# Altium project esp32_motor_driver.PrjPcb
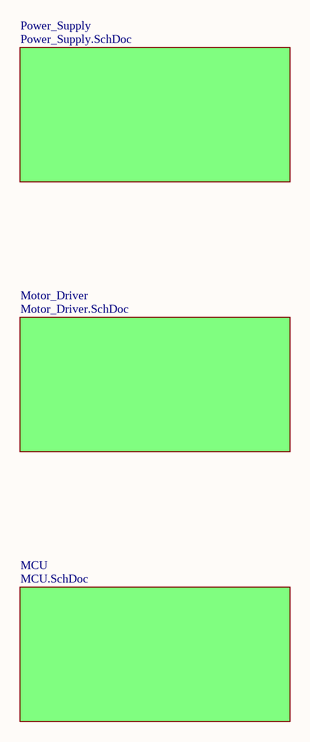
[diagram p0: Top_Level.SchDoc]
Description1: It's RC Cars that play Laser Tag!; Description2: totally home made, totally 3D printer, totall cool; Description3: tell your friends; Engineer: Daniel Mortenson; Really_Cool_Title: Remote Control Car Laser Tag (RCCLT); Revision: 1; Version: 2
4 sheets, 12 parts. Net scope: global (net labels, ports and power ports of the same name join across sheets).
Board file: RCCLTV2.PcbDoc
Sheets:
  Top_Level.SchDoc
    Power_Supply = Power_Supply.SchDoc
    Motor_Driver = Motor_Driver.SchDoc
    MCU = MCU.SchDoc

## Sheet Top_Level.SchDoc
size Tabloid; SheetNumber: 2; SheetTotal: 2

### Sub-sheets
MCU = MCU.SchDoc: no entries
Motor_Driver = Motor_Driver.SchDoc: no entries
Power_Supply = Power_Supply.SchDoc: no entries

### Notes on the sheet
- Insert really cool logo here
- Really_Cool_Title:
- Revision:
- Desciption:
- Version:
- Engineer:

## Sheet Power_Supply.SchDoc
size Tabloid; SheetNumber: 3; SheetTotal: 4
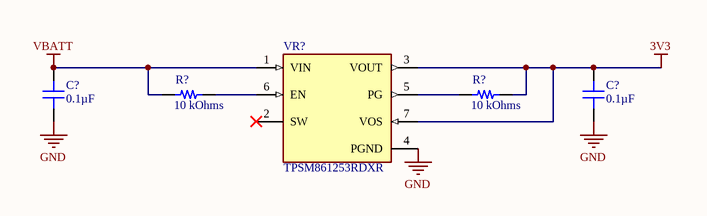
[diagram p1: Power_Supply.SchDoc]

### Parts
(Parts that share a designator on the sheet are numbered #1, #2 ... from top to bottom, then left to right.)
C?#1  0.1µF  [CAP 0603_1608]
C?#2  0.1µF  [CAP 0603_1608]
R?#1  10 kOhms  [RES 0603_1608]
R?#2  10 kOhms  [RES 0603_1608]
U8  TPSM861253RDXR  [VREG_TPSM861253RDXR]

### Nets
3V3: C?#2.2 R?#2.2 U8.3(VOUT) U8.7(VOS)
GND: C?#1.1 C?#2.1 U8.4(PGND)
VBATT: C?#1.2 R?#1.1 U8.1(VIN)
NetR?#1_2: R?#1.2 U8.6(EN)
NetR?#2_1: R?#2.1 U8.5(PG)

Not connected (* = marked no-connect by the designer): U8 2(SW)*

### Notes on the sheet
- Insert really cool logo here
- Really_Cool_Title:
- Revision:
- Desciption:
- Version:
- Engineer:

### Library data of the parts
C?#1 C?#2 = 06033G104MAT2A: CAP CER 0.1UF 25V Y5V 0603; manufacturer: AVX Corporation; Temperature Coefficient: Y5V (F); Tolerance: ±20%; Part Number: 06033G104MAT2A; Value: 0.1µF; Applications: General Purpose; Capacitance: 0.1µF; componentlink1description: Datasheet; componentlink1url: http://datasheets.avx.com/Y5V.pdf; componentlink2description: DigiKey Link; componentlink2url: http://digikey.com/product-detail/en/avx-corporation/06033G104MAT2A/478-11369-1-ND/8019122; Device Package: 0603 (1608 Metric); lastupdated: 9/2/2020 1:03:16 AM; Lifecycle Status: Active; Minimum Order: 1; Mounting Type: Surface Mount, MLCC; Operating Temperature: -30°C ~ 85°C; Package / Case: 0603 (1608 Metric); packaging: TapeAndReel; partid: 13439; Part Status: Active; price: 0.02; series: -; Size / Dimension: 0.063" L x 0.032" W (1.60mm x 0.81mm); Supplier 1: DigiKey; Supplier Part Number 1: 478-11369-1-ND; Thickness (Max): 0.035" (0.90mm); Voltage - Rated: 25V
R?#1 R?#2 = CRCW060310K0JNEA: RES SMD 10K OHM 5% 1/10W 0603; Manufacturer: Vishay Dale; Power (Watts): 0.1W, 1/10W; Temperature Coefficient: ±200ppm/°C; Part Number: CRCW060310K0JNEA; Value: 10 kOhms; ComponentLink1Description: Datasheet; ComponentLink1URL: http://www.vishay.com/docs/20035/dcrcwe3.pdf; ComponentLink2Description: DigiKey Link; ComponentLink2URL: https://www.digikey.com/en/products/detail/vishay-dale/CRCW060310K0JNEA/1174253; Composition: Thick Film; Device Package: 0603 (1608 Metric); Features: Automotive AEC-Q200; Height - Seated (Max): 0.020" (0.50mm); LastUpdated: 2/9/2024 8:43:35 PM; Lifecycle Status: Active; Minimum Order: 1; Number of Terminations: 2; Operating Temperature: -55°C ~ 155°C; Package / Case: 0603 (1608 Metric); Packaging: CutTape; PartId: 5216; Part Status: Active; Price: 0.01; Ratings: AEC-Q200; Resistance: 10 kOhms; Series: CRCW; Size / Dimension: 0.063" L x 0.033" W (1.60mm x 0.85mm); Supplier 1: DigiKey; Supplier Part Number 1: 541-10KGCT-ND; Supplier Device Package: 0603; Tolerance: ±5%
U8 = TPSM861253RDXR: 3V to 17V input voltage, 3.3V, 1A output synchronous buck module in QFN package; MF: Texas Instruments

## Sheet Motor_Driver.SchDoc
size Tabloid; SheetNumber: 4; SheetTotal: 4
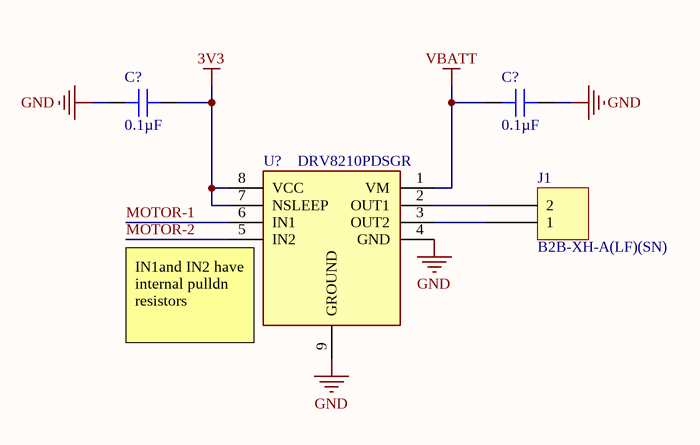
[diagram p2: Motor_Driver.SchDoc]

### Parts
(Parts that share a designator on the sheet are numbered #1, #2 ... from top to bottom, then left to right.)
C?#3  0.1µF  [CAP 0603_1608]
C?#4  0.1µF  [CAP 0603_1608]
J1  B2B-XH-A(LF)(SN)  [JST XH B2B-XH-A]
U9  DRV8210PDSGR  [SON50P200X200X80-9N]

### Nets
3V3: C?#3.2 U9.7(NSLEEP) U9.8(VCC)
GND: C?#3.1 C?#4.2 U9.4(GND) U9.9(GROUND)
VBATT: C?#4.1 U9.1(VM)
MOTOR-1: U9.6(IN1)
MOTOR-2: U9.5(IN2)
NetJ1_1: J1.1 U9.3(OUT2)
NetJ1_2: J1.2 U9.2(OUT1)

### Notes on the sheet
- (near U9) IN1and IN2 have internal pulldn resistors
- Insert really cool logo here
- Really_Cool_Title:
- Revision:
- Desciption:
- Version:
- Engineer:

### Library data of the parts
C?#3 C?#4 = 06033G104MAT2A: as C?#1 on sheet Power_Supply; Part Number: 06033G104MAT2A; Value: 0.1µF; Applications: General Purpose; Capacitance: 0.1µF; componentlink1description: Datasheet; componentlink1url: http://datasheets.avx.com/Y5V.pdf; componentlink2description: DigiKey Link; componentlink2url: http://digikey.com/product-detail/en/avx-corporation/06033G104MAT2A/478-11369-1-ND/8019122; Device Package: 0603 (1608 Metric); lastupdated: 9/2/2020 1:03:16 AM; Lifecycle Status: Active; Minimum Order: 1; Mounting Type: Surface Mount, MLCC; Operating Temperature: -30°C ~ 85°C; Package / Case: 0603 (1608 Metric); packaging: TapeAndReel; partid: 13439; Part Status: Active; price: 0.02; series: -; Size / Dimension: 0.063" L x 0.032" W (1.60mm x 0.81mm); Supplier 1: DigiKey; Supplier Part Number 1: 478-11369-1-ND; Thickness (Max): 0.035" (0.90mm); Voltage - Rated: 25V
J1 = B2B-XH-A(LF)(SN): CONN HEADER VERT 2POS 2.5MM; Manufacturer: JST Sales America Inc.; Contact Length - Post: 0.134" (3.40mm); Current Rating (Amps): 3A; Material Flammability Rating: UL94 V-0; Number of Positions: 2; Number of Positions Loaded: All; Pitch - Mating: 0.098" (2.50mm); Shrouding: Shrouded - 4 Wall; Style: Board to Cable/Wire; Voltage Rating: 250V; Part Number: B2B-XH-A(LF)(SN); ComponentLink1Description: Datasheet; ComponentLink1URL: http://www.jst-mfg.com/product/pdf/eng/eXH.pdf; ComponentLink2Description: DigiKey Link; ComponentLink2URL: http://digikey.com/product-detail/en/jst-sales-america-inc/B2B-XH-A-LF-SN/455-2247-ND/1651045; Connector Type: Header; Contact Finish - Mating: Tin; Contact Finish - Post: Tin; Contact Material: Brass; Contact Shape: Square; Contact Type: Male Pin; Fastening Type: Detent Lock; Insulation Color: Natural; Insulation Height: 0.276" (7.00mm); Insulation Material: Polyamide (PA66), Nylon 6/6; LastUpdated: 1/12/2020 11:46:08 PM; Lifecycle Status: Active; Minimum Order: 1; Mounting Type: Through Hole; Number of Rows: 1; Operating Temperature: -25°C ~ 85°C; Packaging: Bulk; PartId: 67; Part Status: Active; Price: 0.15; Series: XH; Supplier 1: DigiKey; Supplier Part Number 1: 455-2247-ND; Termination: Press-Fit, Solder
U9 = DRV8210PDSGR: Integrated Circuit; Manufacturer_Name: Texas Instruments; Datasheet Link: https://www.ti.com/lit/gpn/drv8210p; Height: 0.8mm; Manufacturer_Part_Number: DRV8210PDSGR; Mouser Part Number: 595-DRV8210PDSGR; Mouser Price/Stock: https://www.mouser.co.uk/ProductDetail/Texas-Instruments/DRV8210PDSGR?qs=eP2BKZSCXI76Q1gdVPvR3A%3D%3D; Arrow Part Number: DRV8210PDSGR; Arrow Price/Stock: https://www.arrow.com/en/products/drv8210pdsgr/texas-instruments?region=nac

## Sheet MCU.SchDoc
size Tabloid; SheetNumber: 2; SheetTotal: 4
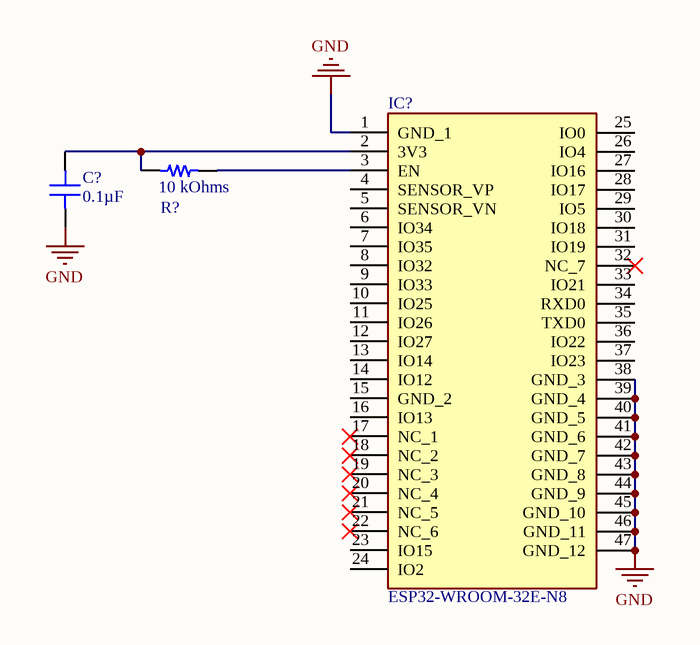
[diagram p3: MCU.SchDoc]

### Parts
(Parts that share a designator on the sheet are numbered #1, #2 ... from top to bottom, then left to right.)
C?#5  0.1µF  [CAP 0603_1608]
R?#3  10 kOhms  [RES 0603_1608]
U2  ESP32-WROOM-32E-N8  [ESP32WROOM32EN8]

### Nets
GND: C?#5.1 U2.1(GND_1) U2.38(GND_3) U2.39(GND_4) U2.40(GND_5) U2.41(GND_6) U2.42(GND_7) U2.43(GND_8) U2.44(GND_9) U2.45(GND_10) U2.46(GND_11) U2.47(GND_12)
NetC?#5_2: C?#5.2 R?#3.1 U2.2(3V3)
NetR?#3_2: R?#3.2 U2.3(EN)

Not connected (* = marked no-connect by the designer): U2 4(SENSOR_VP) 5(SENSOR_VN) 6(IO34) 7(IO35) 8(IO32) 9(IO33) 10(IO25) 11(IO26) 12(IO27) 13(IO14) 14(IO12) 15(GND_2) 16(IO13) 17(NC_1)* 18(NC_2)* 19(NC_3)* 20(NC_4)* 21(NC_5)* 22(NC_6)* 23(IO15) 24(IO2) 25(IO0) 26(IO4) 27(IO16) 28(IO17) 29(IO5) 30(IO18) 31(IO19) 32(NC_7)* 33(IO21) 34(RXD0) 35(TXD0) 36(IO22) 37(IO23)

### Notes on the sheet
- Insert really cool logo here
- Really_Cool_Title:
- Revision:
- Desciption:
- Version:
- Engineer:

### Library data of the parts
C?#5 = 06033G104MAT2A: as C?#1 on sheet Power_Supply; Part Number: 06033G104MAT2A; Value: 0.1µF; Applications: General Purpose; Capacitance: 0.1µF; componentlink1description: Datasheet; componentlink1url: http://datasheets.avx.com/Y5V.pdf; componentlink2description: DigiKey Link; componentlink2url: http://digikey.com/product-detail/en/avx-corporation/06033G104MAT2A/478-11369-1-ND/8019122; Device Package: 0603 (1608 Metric); lastupdated: 9/2/2020 1:03:16 AM; Lifecycle Status: Active; Minimum Order: 1; Mounting Type: Surface Mount, MLCC; Operating Temperature: -30°C ~ 85°C; Package / Case: 0603 (1608 Metric); packaging: TapeAndReel; partid: 13439; Part Status: Active; price: 0.02; series: -; Size / Dimension: 0.063" L x 0.032" W (1.60mm x 0.81mm); Supplier 1: DigiKey; Supplier Part Number 1: 478-11369-1-ND; Thickness (Max): 0.035" (0.90mm); Voltage - Rated: 25V
R?#3 = CRCW060310K0JNEA: as R?#1 on sheet Power_Supply; Part Number: CRCW060310K0JNEA; Value: 10 kOhms; ComponentLink1Description: Datasheet; ComponentLink1URL: http://www.vishay.com/docs/20035/dcrcwe3.pdf; ComponentLink2Description: DigiKey Link; ComponentLink2URL: https://www.digikey.com/en/products/detail/vishay-dale/CRCW060310K0JNEA/1174253; Composition: Thick Film; Device Package: 0603 (1608 Metric); Features: Automotive AEC-Q200; Height - Seated (Max): 0.020" (0.50mm); LastUpdated: 2/9/2024 8:43:35 PM; Lifecycle Status: Active; Minimum Order: 1; Number of Terminations: 2; Operating Temperature: -55°C ~ 155°C; Package / Case: 0603 (1608 Metric); Packaging: CutTape; PartId: 5216; Part Status: Active; Price: 0.01; Ratings: AEC-Q200; Resistance: 10 kOhms; Series: CRCW; Size / Dimension: 0.063" L x 0.033" W (1.60mm x 0.85mm); Supplier 1: DigiKey; Supplier Part Number 1: 541-10KGCT-ND; Supplier Device Package: 0603; Tolerance: ±5%
U2 = ESP32-WROOM-32E-N8: Integrated Circuit; Manufacturer_Name: Espressif Systems

## Nets that join several sheets
3V3: Power_Supply (C?#2.2 R?#2.2 U8.3 U8.7), Motor_Driver (C?#3.2 U9.7 U9.8)
GND: Power_Supply (C?#1.1 C?#2.1 U8.4), Motor_Driver (C?#3.1 C?#4.2 U9.4 U9.9), MCU (12 pins)
VBATT: Power_Supply (C?#1.2 R?#1.1 U8.1), Motor_Driver (C?#4.1 U9.1)